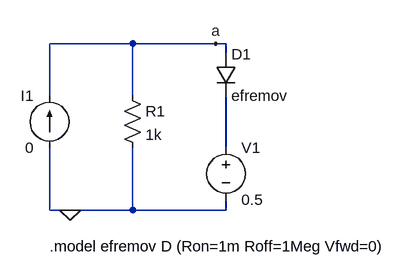
[diagram p0: schematic task_2a.asc]
task_2a.asc, the LTspice schematic file:
Version 4
SHEET 1 880 680
WIRE 192 96 64 96
WIRE 320 96 192 96
WIRE 336 96 320 96
WIRE 336 112 336 96
WIRE 64 176 64 96
WIRE 192 176 192 96
WIRE 336 256 336 176
WIRE 64 352 64 256
WIRE 96 352 64 352
WIRE 192 352 192 256
WIRE 192 352 96 352
WIRE 336 352 336 336
WIRE 336 352 192 352
FLAG 96 352 0
FLAG 320 96 a
SYMBOL current 64 256 R180
WINDOW 0 24 80 Left 2
WINDOW 3 24 0 Left 2
WINDOW 123 24 -28 Left 2
WINDOW 39 0 0 Left 0
SYMATTR InstName I1
SYMATTR Value 0
SYMBOL res 176 160 R0
SYMATTR InstName R1
SYMATTR Value 1k
SYMBOL diode 320 112 R0
SYMATTR InstName D1
SYMATTR Value efremov
SYMBOL voltage 336 240 R0
WINDOW 123 24 124 Left 2
WINDOW 39 0 0 Left 0
SYMATTR InstName V1
SYMATTR Value 0.5
TEXT 64 408 Left 2 !.model efremov D (Ron=1m Roff=1Meg Vfwd=0)

The netlist it stands for:
* task_2a.asc
I1 0 a 0
R1 a 0 1k
D1 a N001 efremov
V1 N001 0 0.5
.model D D
.lib standard.dio
.model efremov D (Ron=1m Roff=1Meg Vfwd=0)
.backanno
.end